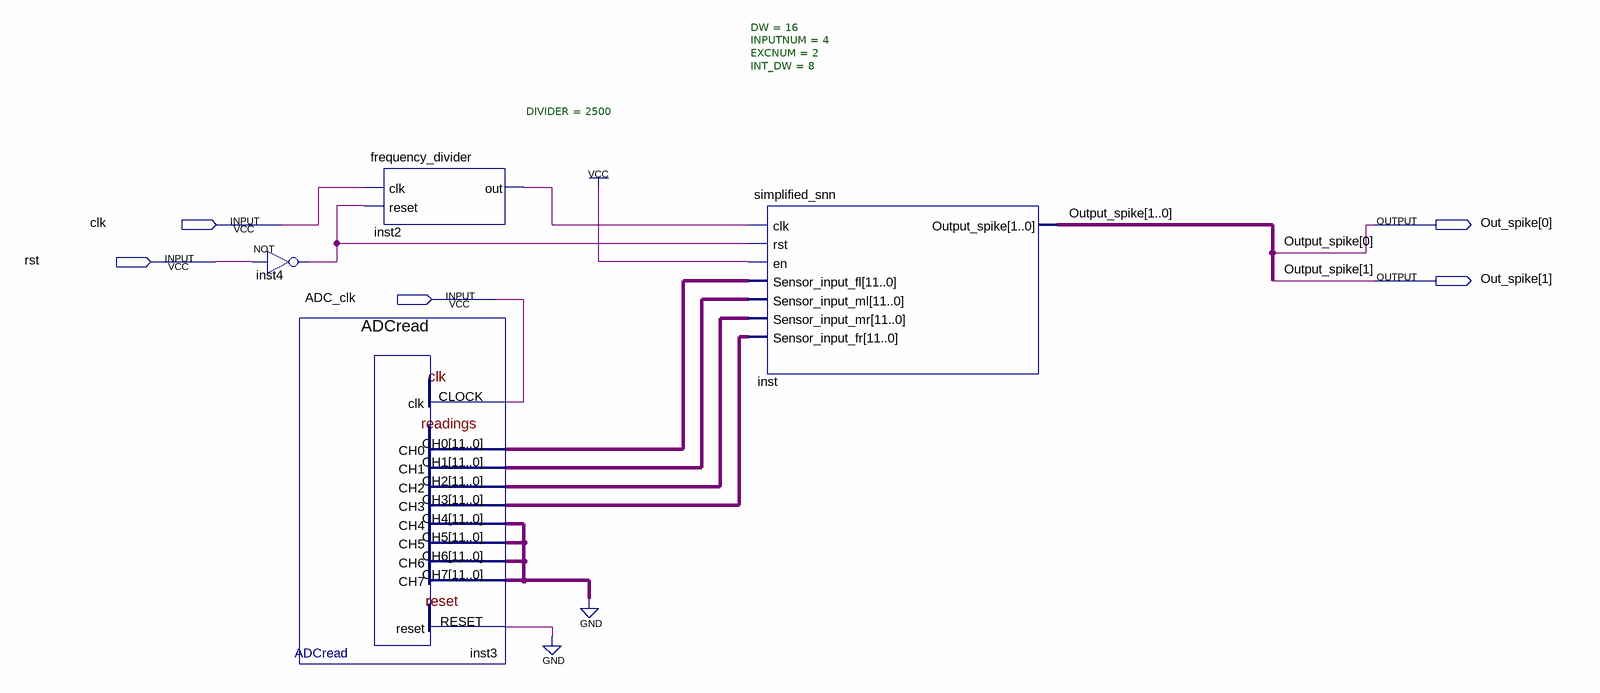
[diagram p0: schematic sheet]
// Quartus schematic top_level_SNN.bdf as structural Verilog: 4 symbols, 5 pins
module top_level_SNN (
  input  clk,
  input  rst,
  input  ADC_clk,
  output [1:0] Out_spike
);

  wire inst2_out, inst4_out;
  wire [11:0] inst3_ch0, inst3_ch1, inst3_ch2, inst3_ch3, inst3_ch4;

  not inst4 (inst4_out, rst);
  ADCread inst3 (
    .CLOCK(ADC_clk), .RESET(1'b0), .CH0(inst3_ch0), .CH1(inst3_ch1), .CH2(inst3_ch2), .CH3(inst3_ch3),
    .CH4(inst3_ch4), .CH5(inst3_ch4), .CH6(inst3_ch4), .CH7(inst3_ch4));
  frequency_divider #(.DIVIDER(2500)) inst2 (.clk(clk), .reset(inst4_out), .out(inst2_out));
  simplified_snn #(.DW(16), .INPUTNUM(4), .EXCNUM(2), .INT_DW(8)) inst (
    .clk(inst2_out), .rst(inst4_out), .en(1'b1), .Sensor_input_fl(inst3_ch0), .Sensor_input_ml(inst3_ch1),
    .Sensor_input_mr(inst3_ch2), .Sensor_input_fr(inst3_ch3), .Output_spike(Out_spike));
  // also tied to GND on the sheet: {inst3_ch4[0], inst3_ch4[1], inst3_ch4[2], inst3_ch4[3], inst3_ch4[4], inst3_ch4[5], inst3_ch4[6], inst3_ch4[7], inst3_ch4[8], inst3_ch4[9], inst3_ch4[10], inst3_ch4[11]}

  // Other names for the same wires on the sheet: Output_spike[1:0] = Out_spike
endmodule
